# EAGLE schematic first (EAGLE 7.2.0)
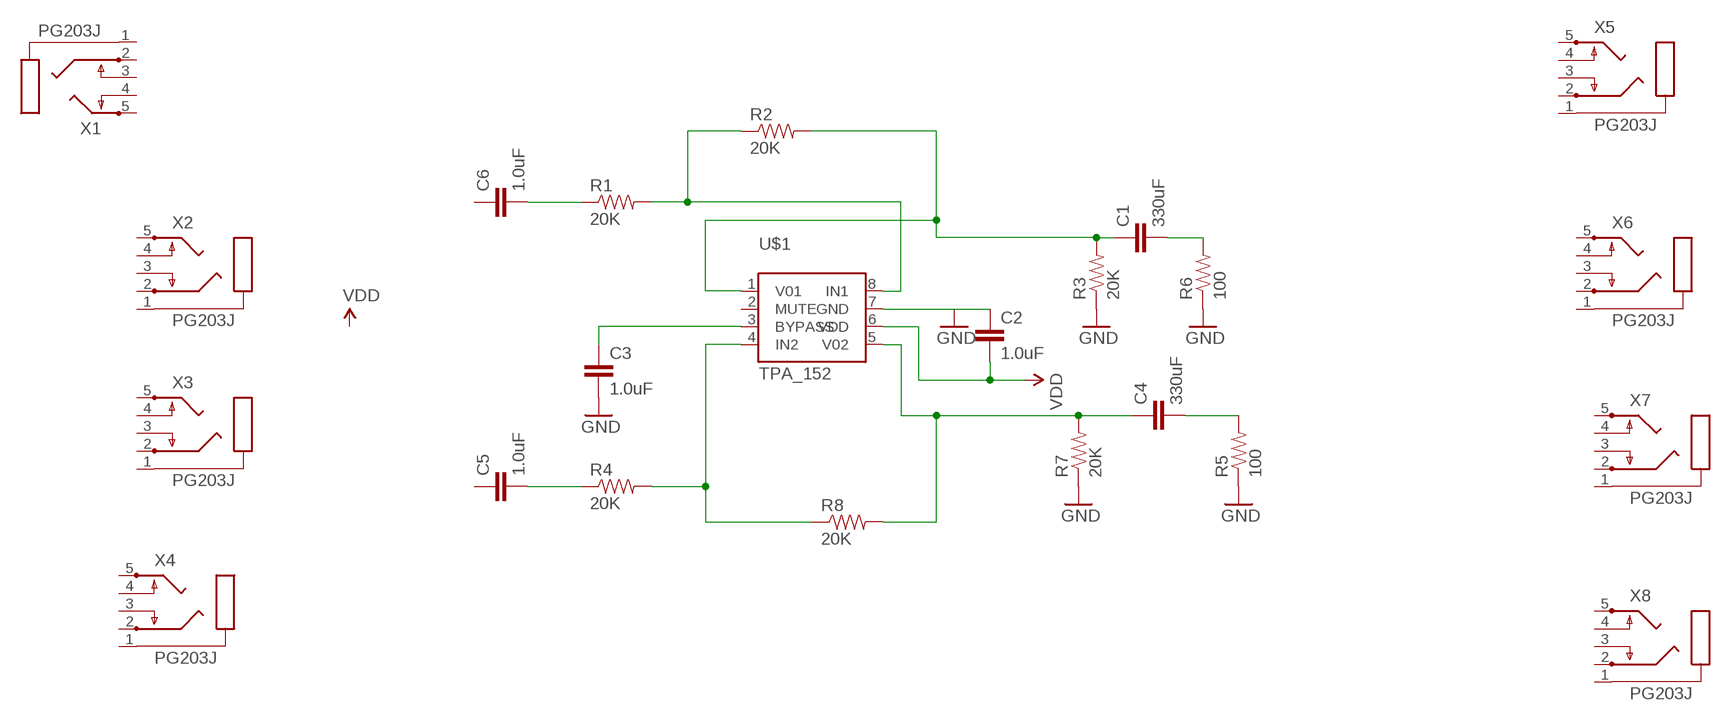
[diagram p0: schematic, sheet 1]

## Parts
C1  330uF  1.0UF-25V-+80/-20(0805)  [0805]
C2  1.0uF  1.0UF-25V-+80/-20(0805)  [0805]
C3  1.0uF  1.0UF-25V-+80/-20(0805)  [0805]
C4  330uF  1.0UF-25V-+80/-20(0805)  [0805]
C5  1.0uF  1.0UF-25V-+80/-20(0805)  [0805]
C6  1.0uF  1.0UF-25V-+80/-20(0805)  [0805]
R1  20K  RESISTORPTH-1/4W  [AXIAL-0.4]
R2  20K  RESISTORPTH-1/4W  [AXIAL-0.4]
R3  20K  RESISTORPTH-1/4W  [AXIAL-0.4]
R4  20K  RESISTORPTH-1/4W  [AXIAL-0.4]
R5  100  RESISTORPTH-1/4W  [AXIAL-0.4]
R6  100  RESISTORPTH-1/4W  [AXIAL-0.4]
R7  20K  RESISTORPTH-1/4W  [AXIAL-0.4]
R8  20K  RESISTORPTH-1/4W  [AXIAL-0.4]
U$1  TPA_152  [SOIC8]
X1  PG203J  [PG203J]
X2  PG203J  [PG203J]
X3  PG203J  [PG203J]
X4  PG203J  [PG203J]
X5  PG203J  [PG203J]
X6  PG203J  [PG203J]
X7  PG203J  [PG203J]
X8  PG203J  [PG203J]

## Nets
GND: C3.2 R3.P$1 R5.P$1 R6.P$1 R7.P$1
N$1: R1.P$2 R2.P$1 U$1.8(IN1)
N$2: C1.1 R2.P$2 R3.P$2 U$1.1(V01)
N$4: R4.P$2 R8.P$1 U$1.4(IN2)
N$5: C4.1 R7.P$2 R8.P$2 U$1.5(V02)
N$6: C1.2 R6.P$2
N$7: C4.2 R5.P$2
N$8: C2.1 U$1.7(GND)
N$9: C3.1 U$1.3(BYPASS)
N$10: C5.2 R4.P$1
N$11: C6.2 R1.P$1
VDD: C2.2 U$1.6(VDD)
Unconnected: C5.1 C6.1 U$1.2(MUTE) X1.1 X1.2 X1.3 X1.4 X1.5 X2.1 X2.2 X2.3 X2.4 X2.5 X3.1 X3.2 X3.3 X3.4 X3.5 X4.1 X4.2 X4.3 X4.4 X4.5 X5.1 X5.2 X5.3 X5.4 X5.5 X6.1 X6.2 X6.3 X6.4 X6.5 X7.1 X7.2 X7.3 X7.4 X7.5 X8.1 X8.2 X8.3 X8.4 X8.5

## Library data of the parts
C1 C4 = SparkFun-Capacitors:1.0UF-25V-+80/-20(0805): CAP-11625; PROD_ID: CAP-11625; VALUE: 1.0uF
C2 C3 C5 C6 = SparkFun-Capacitors:1.0UF-25V-+80/-20(0805): CAP-11625; PROD_ID: CAP-11625
R1-R8 = SparkFun-Passives:RESISTOR: Resistor Basic schematic elements and footprints for 0603, 1206, and PTH resistors.
U$1 = TPA_152:TPA_152
X1-X8 = con-hirschmann:PG203J: MIC/HEADPHONE JACK KS-S stereo microphone/headphone jack PG203JN (Schukat); OC_FARNELL: unknown; OC_NEWARK: unknown